# EAGLE design linea base 2 (EAGLE 9.6.2)
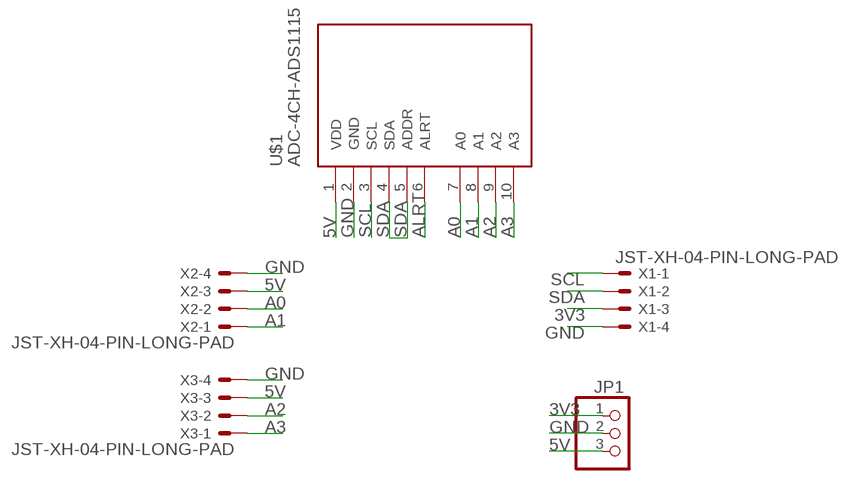
[diagram p0: schematic, sheet 1]

## Parts
JP1  PINHD-1X3  [1X03]
U$1  ADC-4CH-ADS1115  [ADC-4CH-ADS1115]
X1  JST-XH-04-PIN-LONG-PAD  [JST-XH-04-PACKAGE-LONG-PAD]
X2  JST-XH-04-PIN-LONG-PAD  [JST-XH-04-PACKAGE-LONG-PAD]
X3  JST-XH-04-PIN-LONG-PAD  [JST-XH-04-PACKAGE-LONG-PAD]

## Nets
3V3: JP1.1 X1.3
5V: JP1.3 U$1.1(VDD) X2.3 X3.3
A0: U$1.7(A0) X2.2
A1: U$1.8(A1) X2.1
A2: U$1.9(A2) X3.2
A3: U$1.10(A3) X3.1
ALRT: U$1.6(ALRT)
GND: JP1.2 U$1.2(GND) X1.4 X2.4 X3.4
SCL: U$1.3(SCL) X1.1
SDA: U$1.4(SDA) U$1.5(ADDR) X1.2

## Library data of the parts
JP1 = adafruit:PINHD-1X3: PIN HEADER
U$1 = diy-modules:ADC-4CH-ADS1115: 4 Channel 16-Bit Analog-to-Digital Converter based on ADS1115 chip Arduino ADS1115 Getting Started Tutorial is available here: http://henrysbench.capnfatz.com/henrys-bench/arduino-voltage-measurements/arduino-ads1115-module-getting-started-tutorial/ ADS1115 datasheet is available here: http://www.ti.com/lit/ds/symlink/ads1115.pdf Click here to find device on ebay.com <http://www.ebay.com/sch/ads1115+module>
X1-X3 = Rembrandt Electronics - JST XH Connectors v1-0:JST-XH-04-PIN: JST XH Connector 2 Pin Wire to board connector. Pitch: 2,54 mm, (0.100") Number of pins: 4 Created by Rembrandt Electronics www.rembrandtelectronics.com

## Board
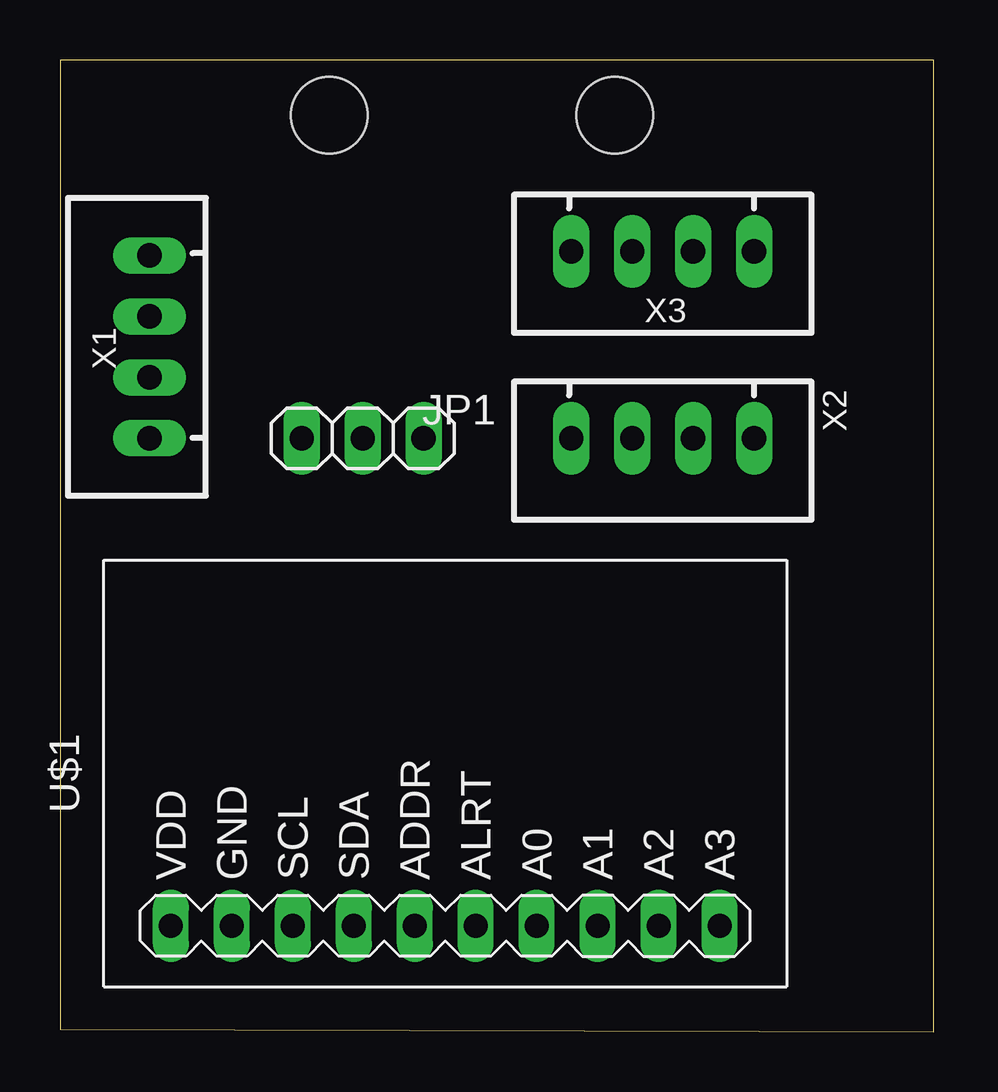
[diagram p1: board, top side]
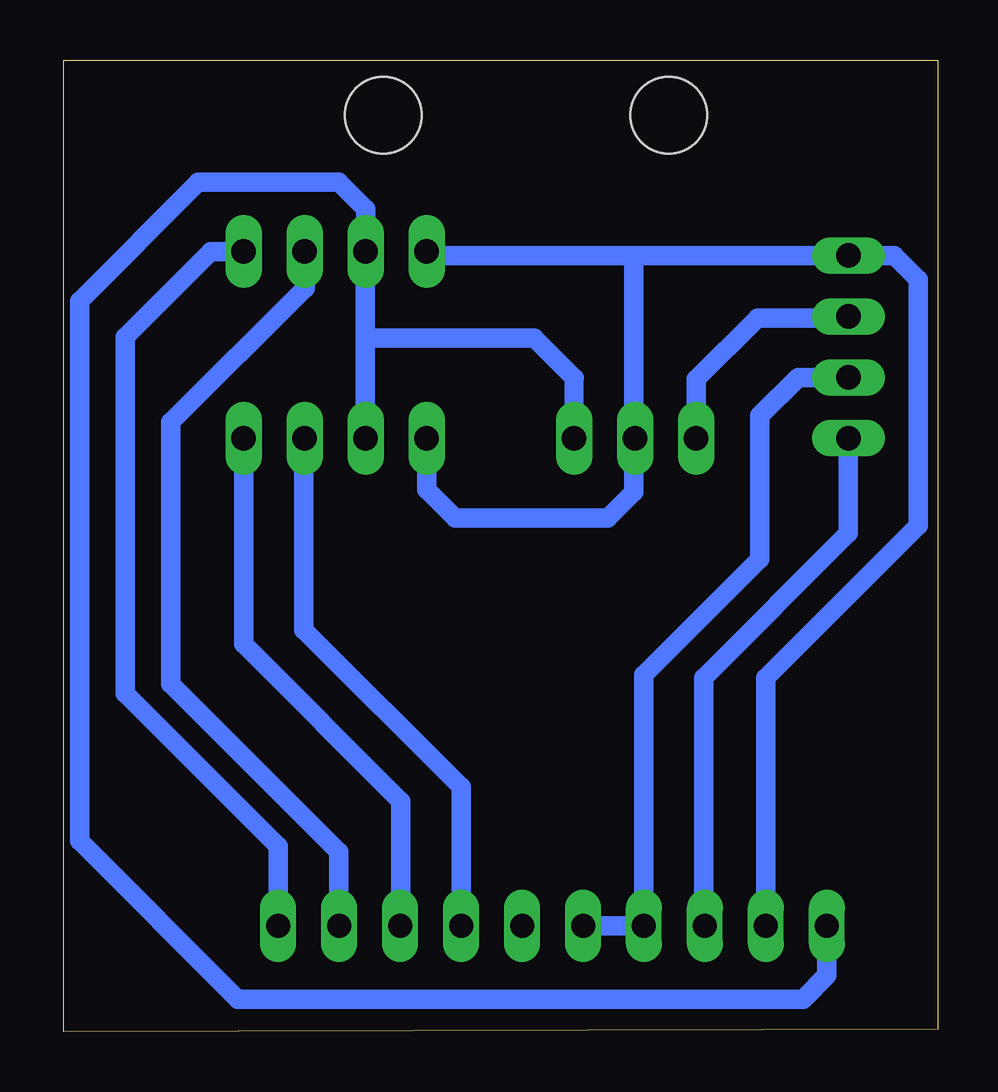
[diagram p2: board, bottom side, seen from below]

Size 36.4 x 40.5 mm. Coordinates in mm from the lower left corner, seen from the top.
Outline: 0,0.1 36.4,0 36.4,40.5 0,40.5 0,0.1
Copper layers (1*16): Top 0.035mm / dielectric 1.5mm / Bottom 0.035mm
Design rules "default *": minimum track width 0.5mm, minimum drill 0.35mm, track to track 0.4mm, track to pad 0.4mm, pad to pad 0.4mm, via to via 0.4mm, smd to smd 6mil, copper to edge 40mil, drill to drill 6mil, minimum pad ring 10mil, minimum via ring 8mil, stop-mask expansion 4mil, vias tented up to drill 0mil, thermal gap 10mil
Holes 3.2 mm at 11.2,38.2 23.1,38.2

### Footprints (pad centres in the part's own frame; a part is rotated, then mirrored left to right if it is on the bottom)
1X03 = drill 1.016 long: 1 -2.54,0; 2 0,0; 3 2.54,0
ADC-4CH-ADS1115 = drill 1 long: 1 -6.35,11.43; 2 -6.35,8.89; 3 -6.35,6.35; 4 -6.35,3.81; 5 -6.35,1.27; 6 -6.35,-1.27; 7 -6.35,-3.81; 8 -6.35,-6.35; 9 -6.35,-8.89; 10 -6.35,-11.43
JST-XH-04-PACKAGE-LONG-PAD = drill 1.016 long: 1 -3.81,0; 2 -1.27,0; 3 1.27,0; 4 3.81,0

### Placement (x,y rotation side)
JP1  12.6,24.73 0 top
U$1  16.04,10.76 90 top
X1  3.71,28.54 90 top
X2  25.1,24.73 180 top
X3  25.1,32.52 180 top

### Tracks (layer width: path | path; a pad name or v marks a point on that pad's centre or on a via)
3V3
  Bottom 0.813: JP1.1 10.06,27.19 7.5,29.75 3.76,29.75 X1.3
5V
  Bottom 0.8: JP1.3 15.14,27.24
  Bottom 0.813: U$1.1 4.61,2.34 5.6,1.35 29.15,1.35 35.75,7.95 35.75,30.45 30.8,35.4 24.95,35.4 23.83,34.28 X3.3 23.85,32.52 23.85,28.9 | 23.85,28.9 23.85,24.75 X2.3 | 15.14,27.24 16.8,28.9 23.85,28.9
A0
  Bottom 0.813: U$1.7 19.85,10.2 26.4,16.75 26.4,24.5 26.37,24.54 X2.2
A1
  Bottom 0.813: X2.1 28.91,16.15 22.36,9.6 22.36,4.44 U$1.8
A2
  Bottom 0.813: X3.2 26.35,32.5 26.35,31 31.95,25.4 31.95,14.5 24.95,7.5 24.95,4.7 24.93,4.67 U$1.9
A3
  Bottom 0.813: U$1.10 27.46,7.71 33.85,14.1 33.85,28.95 30.28,32.52 X3.1
GND
  Bottom 0.813: X2.4 21.29,22.59 20.1,21.4 13.75,21.4 12.65,22.5 12.65,24.6 JP1.2 12.65,24.85 12.65,32.35 | U$1.2 7.15,14.75 0.8,21.1 0.8,31.35 1.8,32.35 X1.4 12.65,32.35 | X3.4 21.12,32.35 12.65,32.35
SCL
  Bottom 0.813: X1.1 3.71,20.79 9.75,14.75 9.75,4.6 9.69,4.56 U$1.3
SDA
  Bottom 0.813: X1.2 5.81,27.27 7.41,25.67 7.41,19.69 12.23,14.87 U$1.4 U$1.5